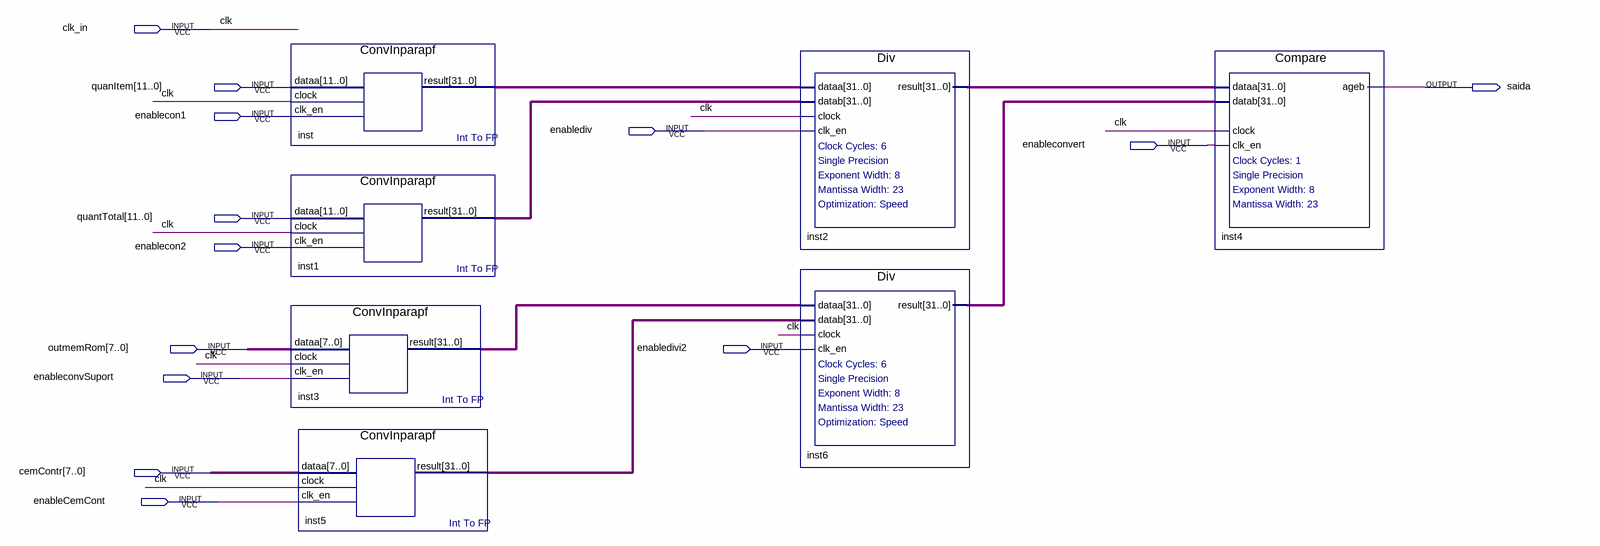
[diagram p0: schematic sheet]
// Quartus schematic moduloPontFlu.bdf as structural Verilog: 7 symbols, 13 pins
module moduloPontFlu (
  input  clk_in,
  input  [11:0] quanItem,
  input  enablecon1,
  input  enablediv,
  input  enableconvert,
  input  [11:0] quantTotal,
  input  enablecon2,
  input  [7:0] outmemRom,
  input  enabledivi2,
  input  enableconvSuport,
  input  [7:0] cemContr,
  input  enableCemCont,
  output saida
);

  wire [31:0] inst1_result, inst2_result, inst3_result, inst5_result, inst6_result, inst_result;

  ConvInparapf inst (.dataa(quanItem), .clock(clk_in), .clk_en(enablecon1), .result(inst_result));
  ConvInparapf inst1 (.dataa(quantTotal), .clock(clk_in), .clk_en(enablecon2), .result(inst1_result));
  ConvInparapf inst3 (.dataa(outmemRom), .clock(clk_in), .clk_en(enableconvSuport), .result(inst3_result));
  ConvInparapf inst5 (.dataa(cemContr), .clock(clk_in), .clk_en(enableCemCont), .result(inst5_result));
  Div inst2 (.dataa(inst_result), .datab(inst1_result), .clock(clk_in), .clk_en(enablediv), .result(inst2_result));
  Div inst6 (.dataa(inst3_result), .datab(inst5_result), .clock(clk_in), .clk_en(enabledivi2), .result(inst6_result));
  Compare inst4 (.dataa(inst2_result), .datab(inst6_result), .clock(clk_in), .clk_en(enableconvert), .ageb(saida));

  // Other names for the same wires on the sheet: clk = clk_in
endmodule
